# EAGLE design T07 -Schematic V5 (EAGLE 7.7.0)
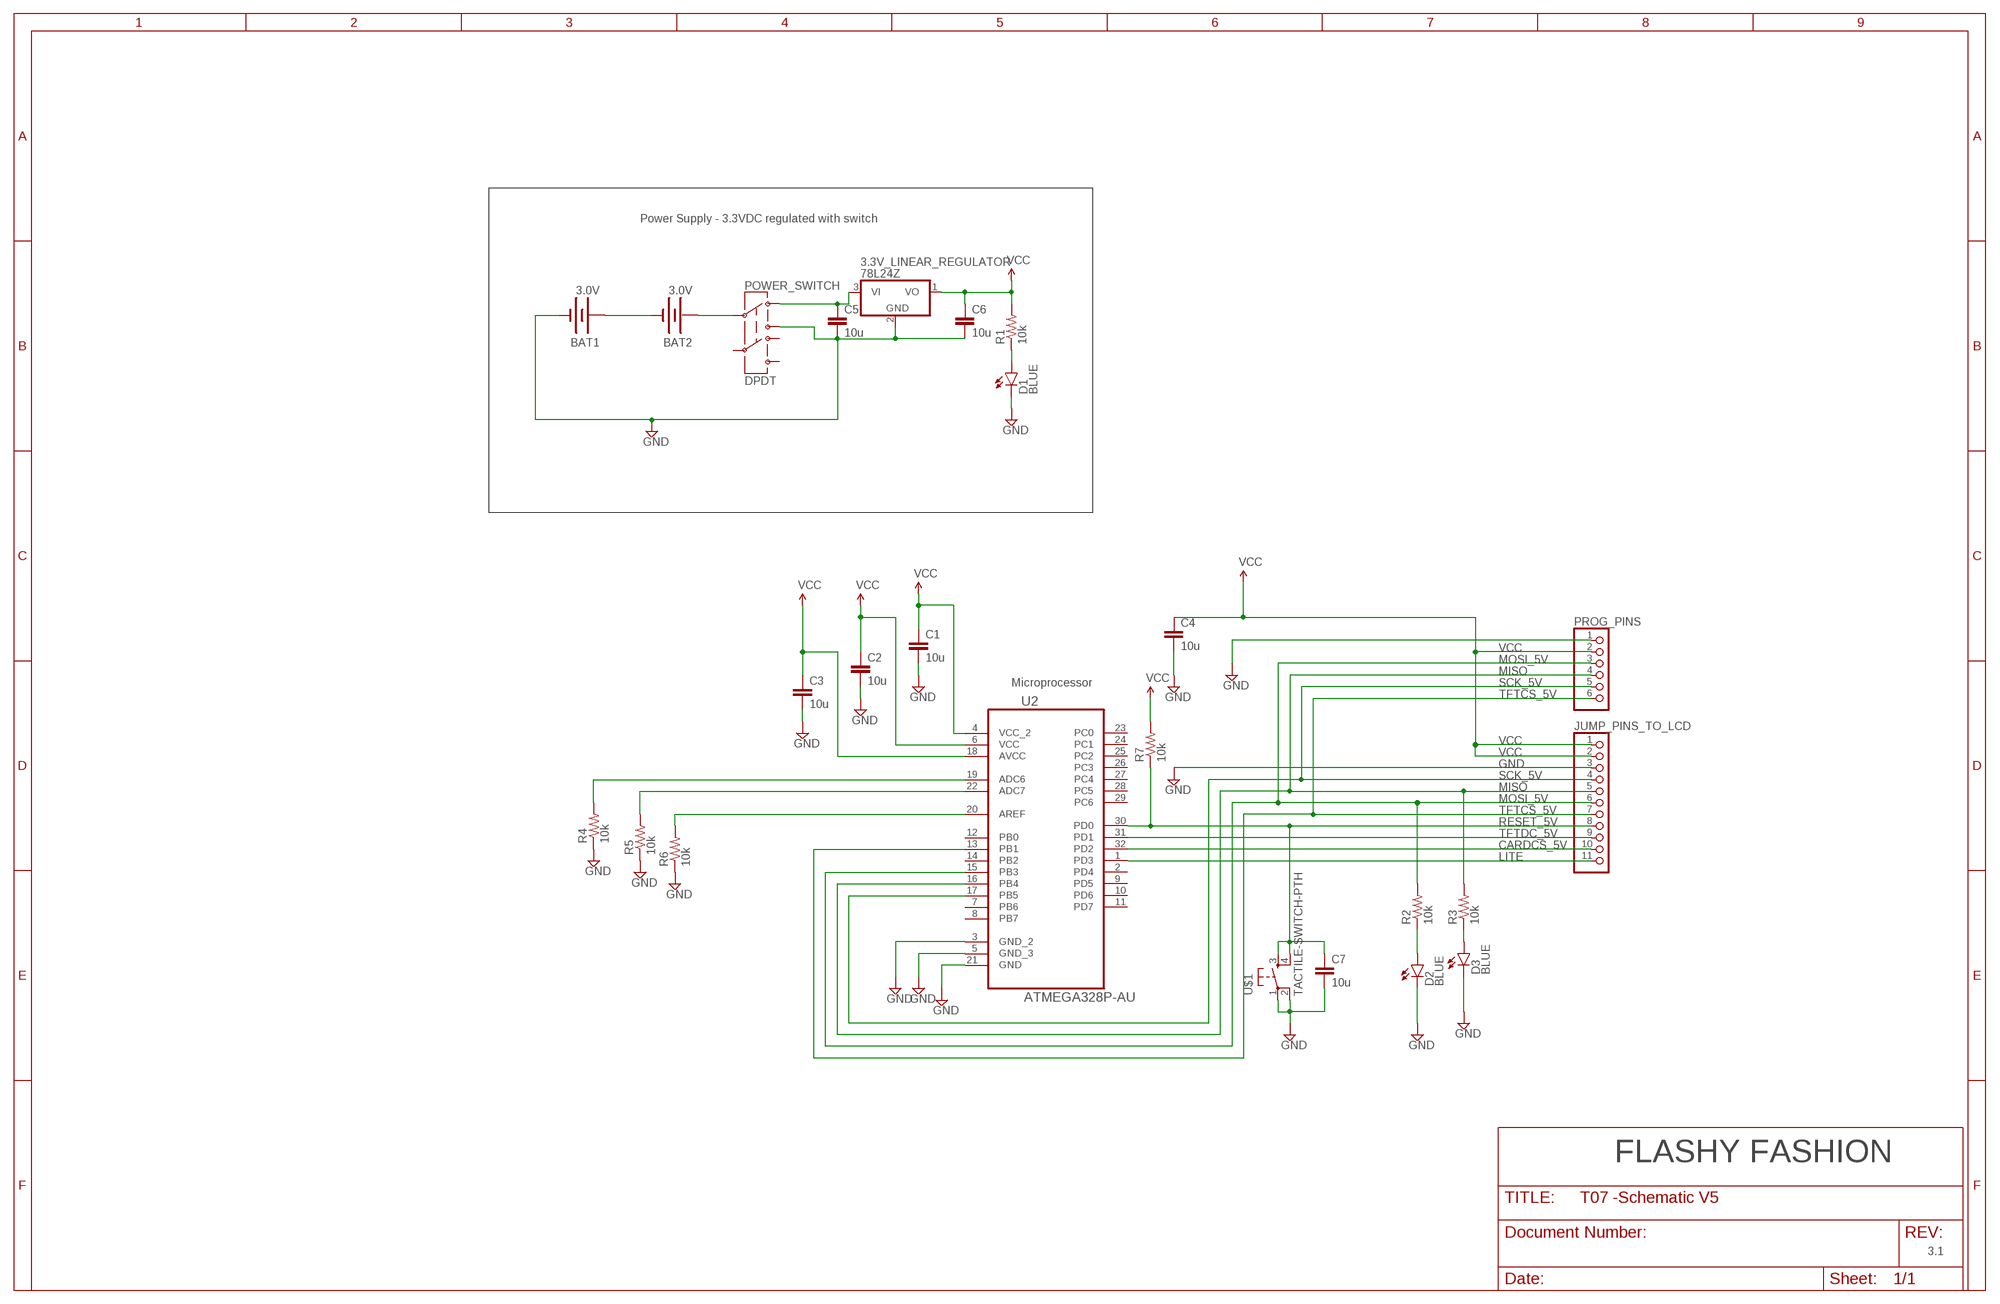
[diagram p0: schematic, sheet 1]

## Parts
3.3V_LINEAR_REGULATOR  78L24Z  [TO92]
BAT1  3.0V  BATTERY245PTH  [BATTCON_245MM_PTH]
BAT2  3.0V  BATTERY245PTH  [BATTCON_245MM_PTH]
C1  10u  CAP1206  [1206]
C2  10u  CAP1206  [1206]
C3  10u  CAP1206  [1206]
C4  10u  CAP1206  [1206]
C5  10u  CAP1206  [1206]
C6  10u  CAP1206  [1206]
C7  10u  CAP1206  [1206]
D1  BLUE  LED-BLUE1206  [LED-1206]
D2  BLUE  LED-BLUE1206  [LED-1206]
D3  BLUE  LED-BLUE1206  [LED-1206]
JUMP_PINS_TO_LCD  HEADER-1X1176MIL  [1X11_ROUND_76]
POWER_SWITCH  DPDT  SWITCH-DPDTAYZ0202  [AYZ0202]
PROG_PINS  PINHD-1X6-3.5MM  [1X06-3.5MM]
R1  10k  RESISTOR1206  [1206]
R2  10k  RESISTOR1206  [1206]
R3  10k  RESISTOR1206  [1206]
R4  10k  RESISTOR1206  [1206]
R5  10k  RESISTOR1206  [1206]
R6  10k  RESISTOR1206  [1206]
R7  10k  RESISTOR1206  [1206]
U2  ATMEGA328P-AU  [QFP80P900X900X120-32N]
U$1  TACTILE-SWITCH-PTH  [TAC-SWITCH-PTH]

## Nets
CARDCS_5V: JUMP_PINS_TO_LCD.10 U2.32(PD2)
GND: 3.3V_LINEAR_REGULATOR.2(GND) BAT1.2(-) C1.2 C2.2 C3.2 C4.2 C5.2 C6.2 C7.2 D1.C D2.C D3.C JUMP_PINS_TO_LCD.3 POWER_SWITCH.3 PROG_PINS.1 R4.1 R5.1 R6.1 U2.3(GND_2) U2.5(GND_3) U2.21(GND) U$1.1 U$1.2
LITE: JUMP_PINS_TO_LCD.11 U2.1(PD3)
MISO: JUMP_PINS_TO_LCD.5 PROG_PINS.4 R3.2 U2.16(PB4)
MOSI_5V: JUMP_PINS_TO_LCD.6 PROG_PINS.3 R2.2 U2.15(PB3)
N$1: BAT1.3(+) BAT2.2(-)
N$3: D1.A R1.1
N$5: R4.2 U2.19(ADC6)
N$6: BAT2.3(+) POWER_SWITCH.2
N$7: 3.3V_LINEAR_REGULATOR.3(VI) C5.1 POWER_SWITCH.1
N$8: D2.A R2.1
N$9: D3.A R3.1
N$10: R5.2 U2.22(ADC7)
N$11: R6.2 U2.20(AREF)
RESET_5V: C7.1 JUMP_PINS_TO_LCD.8 R7.1 U2.30(PD0) U$1.3 U$1.4
SCK_5V: JUMP_PINS_TO_LCD.4 PROG_PINS.5 U2.17(PB5)
TFTCS_5V: JUMP_PINS_TO_LCD.7 PROG_PINS.6 U2.13(PB1)
TFTDC_5V: JUMP_PINS_TO_LCD.9 U2.31(PD1)
VCC: 3.3V_LINEAR_REGULATOR.1(VO) C1.1 C2.1 C3.1 C4.1 C6.1 JUMP_PINS_TO_LCD.1 JUMP_PINS_TO_LCD.2 PROG_PINS.2 R1.2 R7.2 U2.4(VCC_2) U2.6(VCC) U2.18(AVCC)
Unconnected: POWER_SWITCH.4 POWER_SWITCH.5 POWER_SWITCH.6 U2.2(PD4) U2.7(PB6) U2.8(PB7) U2.9(PD5) U2.10(PD6) U2.11(PD7) U2.12(PB0) U2.14(PB2) U2.23(PC0) U2.24(PC1) U2.25(PC2) U2.26(PC3) U2.27(PC4) U2.28(PC5) U2.29(PC6)

## Notes on the sheet
- Power Supply - 3.3VDC regulated with switch
- Microprocessor
- FLASHY FASHION
- 3.1

## Library data of the parts
3.3V_LINEAR_REGULATOR = adafruit:78*: Positive VOLTAGE REGULATOR Added bigger pads to the TO-92 package
BAT1 BAT2 = SparkFun-Electromechanical:BATTERY: Battery Holders Various common sizes : AA, AAA, 18650 (PRT-12895), 20mm coin cell and 12mm coin cell. 20MM_4LEGS, BATT-10373
C1-C5 C7 = SparkFun-Capacitors:CAP: Capacitor Standard 0603 ceramic capacitor, and 0.1" leaded capacitor.
C6 = SparkFun-Passives:CAP: Capacitor Standard 0603 ceramic capacitor, and 0.1" leaded capacitor.
D1-D3 = SparkFun-LED:LED-BLUE: Blue LEDs for production use Various blue LEDs stocked by SparkFun production 0603 - DIO-08575 Rebel - DIO-09553 1206 - DIO-09911; PROD_ID: DIO-09911
JUMP_PINS_TO_LCD = microbuilder:HEADER-1X11
POWER_SWITCH = SparkFun-Electromechanical:SWITCH-DPDT: DPDT Version of the COM-00597; PROD_ID: SWCH-08179
PROG_PINS = adafruit:PINHD-1X6: PIN HEADER
R1-R6 = SparkFun-Resistors:RESISTOR: Resistor Basic schematic elements and footprints for 0603, 1206, and PTH resistors.
R7 = SparkFun-Passives:RESISTOR: Resistor Basic schematic elements and footprints for 0603, 1206, and PTH resistors.
U2 = Atmel_By_element14_Batch_1-00:ATMEGA328P-AU: 8-bit Microcontroller with In-System Programmable Flash; MPN: ATMEGA328P-AU; OC_FARNELL: 1715486; OC_NEWARK: 14R4631; PACKAGE: TQFP-32; SUPPLIER: Atmel
U$1 = GeekAmmo:TACTILE-SWITCH: Tactile Switch 4 Pins, SPST NO

## Net classes
1 power: width 0.406 mm

## Board
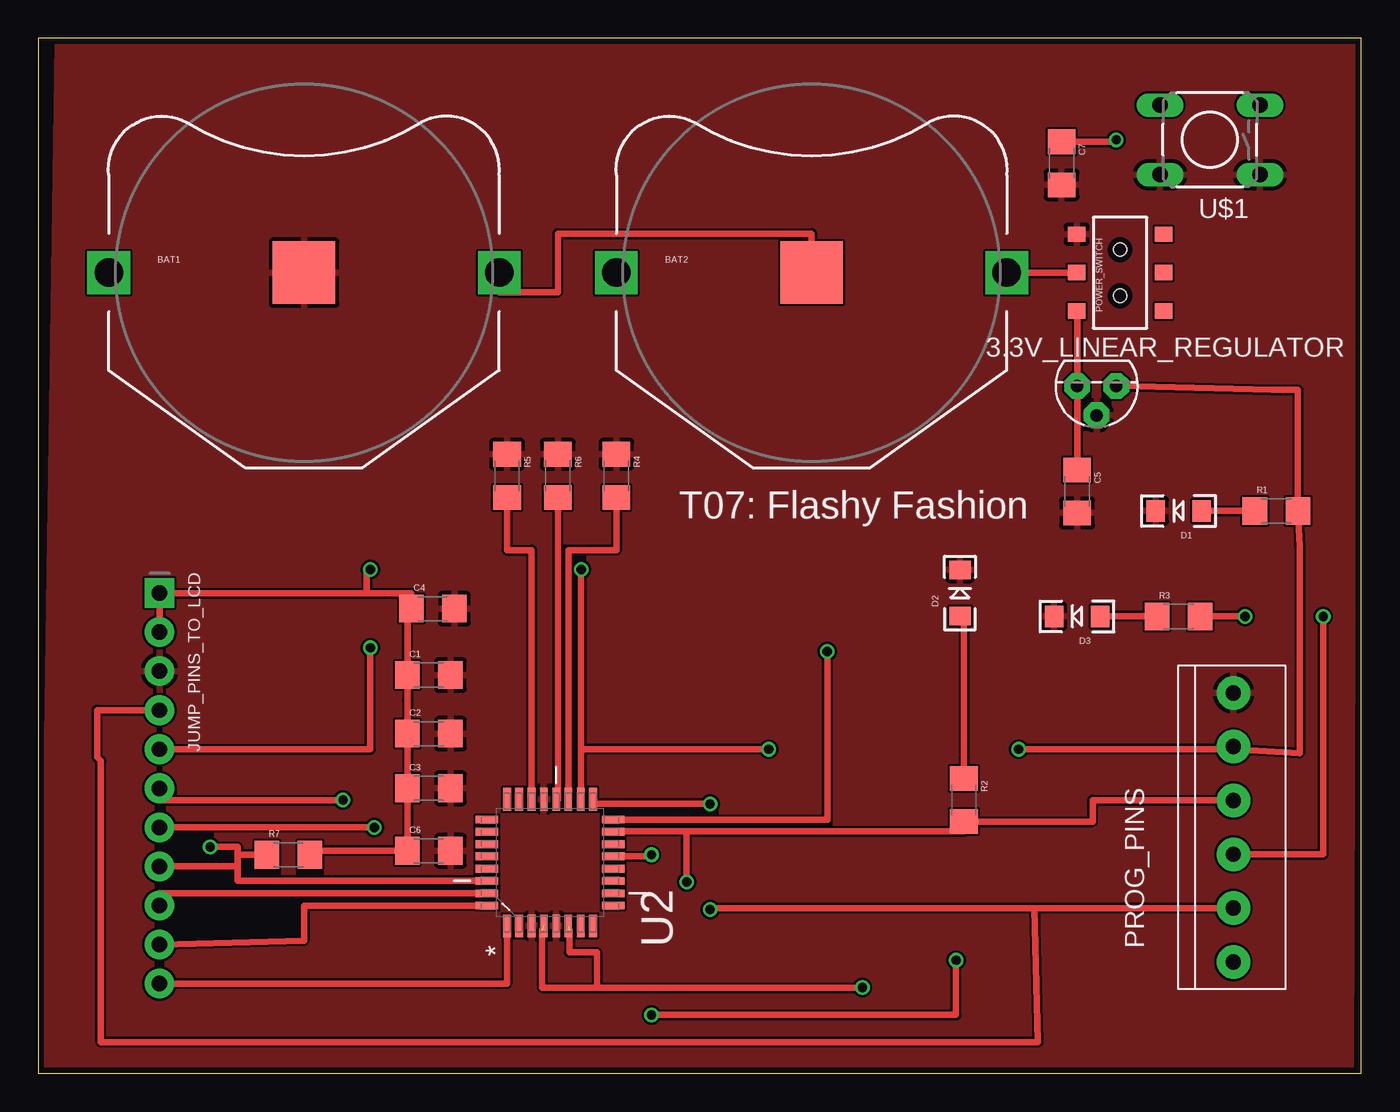
[diagram p1: board, top side]
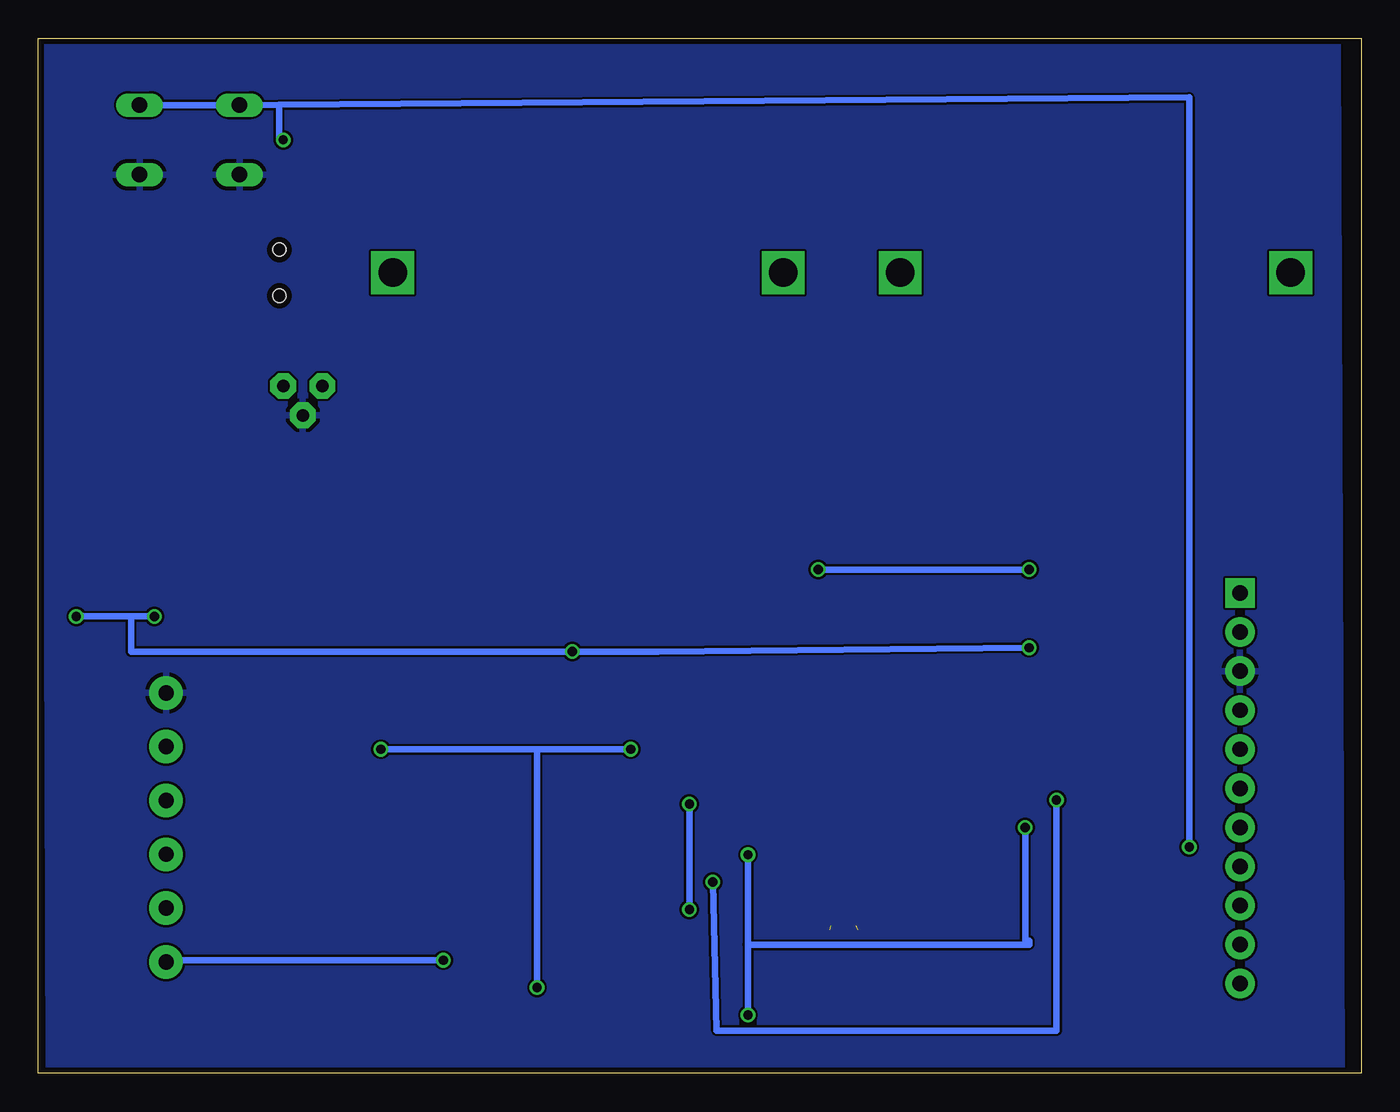
[diagram p2: board, bottom side, seen from below]

Size 86.03 x 67.3 mm. Coordinates in mm from the lower left corner, seen from the top.
Outline: 0,0 86.03,0 86.03,67.3 0,67.3 0,0
Copper layers (1*16): Top 0.0356mm / dielectric 1.5011mm / Bottom 0.0356mm
Design rules "tysons_rules": minimum track width 6mil, minimum drill 13mil, track to track 6mil, track to pad 6mil, pad to pad 6mil, via to via 6mil, smd to smd 6mil, copper to edge 15mil, drill to drill 6mil, minimum pad ring 7mil, minimum via ring 7mil, stop-mask expansion 2.5mil, vias tented up to drill 0mil, thermal gap 10mil

### Footprints (pad centres in the part's own frame; a part is rotated, then mirrored left to right if it is on the bottom)
TO92 = drill 0.813 pad 1.676 octagon: 1 -1.27,0; 2 0,1.905; 3 1.27,0
BATTCON_245MM_PTH = drill 1.854 square: 1 -12.7,0; 3 12.7,0 | smd 4.064 x 4.064: 2 0,0
1206 = smd 1.6 x 1.8: 1 -1.4,0; 2 1.4,0
LED-1206 = smd 1.2 x 1.4: A -1.5,0; C 1.5,0
1X11_ROUND_76 = drill 1 pad 1.93 square: 1 -12.7,0 | drill 1 pad 1.93: 2 -10.16,0; 3 -7.62,0; 4 -5.08,0; 5 -2.54,0; 6 0,0; 7 2.54,0; 8 5.08,0; 9 7.62,0; 10 10.16,0; 11 12.7,0
AYZ0202 = smd 1 x 1.15: 1 -2.5,2.825; 2 0,2.825; 3 2.5,2.825; 4 -2.5,-2.825; 5 0,-2.825; 6 2.5,-2.825 | hole 0.85: 1.5,0; -1.5,0
1X06-3.5MM = drill 1 pad 2.184: 1 -8.75,0; 2 -5.25,0; 3 -1.75,0; 4 1.75,0; 5 5.25,0; 6 8.75,0
QFP80P900X900X120-32N = smd 1.473 x 0.508: 1 -4.115,2.794; 2 -4.115,2.007; 3 -4.115,1.194; 4 -4.115,0.406; 5 -4.115,-0.406; 6 -4.115,-1.194; 7 -4.115,-2.007; 8 -4.115,-2.794; 17 4.115,-2.794; 18 4.115,-2.007; 19 4.115,-1.194; 20 4.115,-0.406; 21 4.115,0.406; 22 4.115,1.194; 23 4.115,2.007; 24 4.115,2.794 | smd 0.508 x 1.473: 9 -2.794,-4.115; 10 -2.007,-4.115; 11 -1.194,-4.115; 12 -0.406,-4.115; 13 0.406,-4.115; 14 1.194,-4.115; 15 2.007,-4.115; 16 2.794,-4.115; 25 2.794,4.115; 26 2.007,4.115; 27 1.194,4.115; 28 0.406,4.115; 29 -0.406,4.115; 30 -1.194,4.115; 31 -2.007,4.115; 32 -2.794,4.115
TAC-SWITCH-PTH = drill 1.016 pad 1.524 long: 1 -3.251,2.261; 2 3.251,2.261; 3 -3.251,-2.261; 4 3.251,-2.261

### Placement (x,y rotation side)
3.3V_LINEAR_REGULATOR  68.83,44.7 180 top
BAT1  17.27,52.07 0 top
BAT2  50.29,52.07 0 top
C1  25.4,25.91 0 top
C2  25.4,22.1 0 top
C3  25.4,18.54 0 top
C4  25.65,30.23 0 top
C5  67.56,37.85 270 top
C6  25.4,14.48 0 top
C7  66.55,59.18 270 top
D1  74.17,36.58 180 top
D2  59.94,31.24 90 top
D3  67.56,29.72 180 top
JUMP_PINS_TO_LCD  7.87,18.54 270 top
POWER_SWITCH  70.36,52.07 90 top
PROG_PINS  77.72,16 270 top
R1  80.52,36.58 0 top
R2  60.2,17.78 270 top
R3  74.17,29.72 0 top
R4  37.59,38.86 270 top
R5  30.48,38.86 270 top
R6  33.78,38.86 270 top
R7  16.26,14.22 0 top
U2  33.27,13.72 90 top
U$1  76.2,60.71 180 top

### Tracks (layer width: path | path; a pad name or v marks a point on that pad's centre or on a via)
CARDCS_5V
  Top 0.406: U2.32 17.27,10.92 17.27,8.64 JUMP_PINS_TO_LCD.10
GND
  Top 0.406: C3.2 26.67,18.8
  pour Bottom: 1.52,67.06 85.6,67.31 85.34,0.25 1.27,0
  pour Top: 1.27,67.06 85.6,66.8 85.34,0.25 0.25,0.25
LITE
  Top 0.406: U2.1 30.48,5.84 JUMP_PINS_TO_LCD.11
MISO  (via drill 0.6)
  Top 0.406: PROG_PINS.4 83.57,14.25 v83.57,29.72 | v78.49,29.72 R3.2 | U2.16 51.31,16.51 v51.31,27.43 | JUMP_PINS_TO_LCD.5 21.59,21.08 v21.59,27.69
  Bottom 0.406: v83.57,29.72 80.01,29.72 | 80.01,29.72 v78.49,29.72 | 80.01,29.72 80.01,27.43 v51.31,27.43 45.72,27.43 v21.59,27.69
MOSI_5V  (via drill 0.6)
  Top 0.406: 42.16,15.75 38.15,15.75 U2.15 | JUMP_PINS_TO_LCD.6 7.87,17.78 v19.81,17.78 | v42.16,12.45 42.16,15.75 | 42.16,15.75 60.2,15.75 R2.2 68.58,16.38 68.58,17.78 78.49,17.78 78.49,17.27 77.72,17.27 PROG_PINS.3
  Bottom 0.406: v19.81,17.78 19.81,2.79 41.91,2.79 v42.16,12.45
N$1
  Top 0.406: BAT1.3 29.97,50.8 33.78,50.8 33.78,54.61 50.29,54.61 BAT2.2
N$3
  Top 0.406: D1.A R1.1
N$5
  Top 0.406: R4.2 37.59,34.04 34.47,34.04 U2.19
N$6
  Top 0.406: BAT2.3 POWER_SWITCH.2
N$7
  Top 0.406: POWER_SWITCH.1 67.56,49.57 3.3V_LINEAR_REGULATOR.3 C5.1
N$8
  Top 0.406: D2.A 60.2,29.74 R2.1
N$9
  Top 0.406: R3.1 D3.A
N$10
  Top 0.406: R5.2 30.48,34.04 32.08,34.04 U2.22
N$11
  Top 0.406: U2.20 33.78,17.83 R6.2
RESET_5V  (via drill 0.6)
  Top 0.406: U2.30 12.95,12.52 12.95,13.46 | 12.95,13.46 JUMP_PINS_TO_LCD.8 | R7.1 12.95,14.22 | 12.95,14.22 12.95,13.46 | v11.18,14.73 12.95,14.73 12.95,14.22 | C7.1 70.1,60.58 v70.1,60.71
  Bottom 0.406: 70.36,62.99 U$1.4 U$1.3 | 70.36,62.99 11.18,63.48 v11.18,14.73 | v70.1,60.71 70.36,60.71 70.36,62.99
SCK_5V  (via drill 0.6)
  Top 0.406: PROG_PINS.5 64.77,10.75 | 64.77,10.75 65.02,2.03 4.06,2.03 4.06,20.32 3.81,20.57 3.81,23.62 JUMP_PINS_TO_LCD.4 | 64.77,10.75 43.69,10.75 v43.69,10.67 | v43.69,17.53 36.07,17.53 U2.17
  Bottom 0.406: v43.69,10.67 v43.69,17.53
TFTCS_5V  (via drill 0.6)
  Top 0.406: U2.13 39.88,14.12 v39.88,14.22 | v21.84,16 JUMP_PINS_TO_LCD.7 | v39.88,3.81 59.69,3.81 v59.69,7.37
  Bottom 0.406: v39.88,14.22 39.88,8.38 | 39.88,8.38 21.59,8.38 21.59,8.64 21.84,8.64 v21.84,16 | 39.88,8.38 v39.88,3.81 | v59.69,7.37 77.72,7.37 PROG_PINS.6
TFTDC_5V
  Top 0.406: U2.31 7.87,11.71 JUMP_PINS_TO_LCD.9 7.87,10.41
VCC  (via drill 0.6)  (2 unrouted)
  Top 0.406: v35.31,32.77 35.28,31.24 35.28,21.08 | 77.72,21.08 82.04,20.83 82.04,34.29 R1.2 81.92,44.45 80.26,44.45 3.3V_LINEAR_REGULATOR.1 | 77.72,21.08 v63.75,21.08 | v47.5,21.08 35.28,21.08 | 36.32,5.59 32.77,5.59 32.77,9.35 | 36.32,5.59 v53.59,5.59 | 34.54,9.35 34.54,7.87 36.32,7.87 36.32,5.59 | 35.28,21.08 U2.18 | PROG_PINS.2 77.72,21.08 | C1.1 C2.1 C3.1 C6.1 17.66,14.48 R7.2 | C1.1 24,24.26 | C1.1 24,30.23 C4.1 24.25,31.24 21.34,31.24 | JUMP_PINS_TO_LCD.2 JUMP_PINS_TO_LCD.1 21.34,31.24 | v21.59,32.77 21.34,32.77 21.34,31.24
  Bottom 0.406: v21.59,32.77 v35.31,32.77 | v63.75,21.08 53.59,21.08 | 53.59,21.08 v47.5,21.08 | v53.59,5.59 53.59,21.08

### Text on the board
tNames: T07: Flashy Fashion